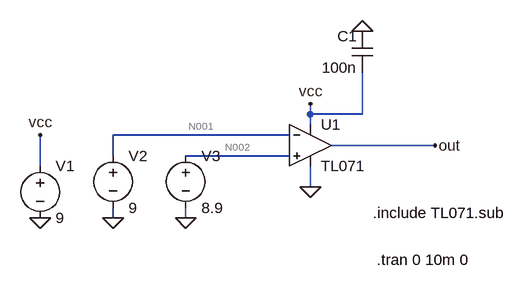
[diagram p0: schematic piezo_w_tl071.asc]
piezo_w_tl071.asc, the LTspice schematic file:
Version 4
SHEET 1 968 680
WIRE 176 112 176 96
WIRE 256 112 256 48
WIRE 256 112 176 112
WIRE 176 128 176 112
WIRE 144 144 -128 144
WIRE 368 160 208 160
WIRE -128 176 -128 144
WIRE 144 176 -16 176
WIRE -240 192 -240 144
WIRE 176 224 176 192
WIRE -128 272 -128 256
WIRE -16 272 -16 256
FLAG 176 224 0
FLAG 176 96 vcc
FLAG -240 272 0
FLAG -240 144 vcc
FLAG 256 -16 0
FLAG -128 272 0
FLAG -16 272 0
FLAG 368 160 out
SYMBOL Opamps\\opamp2 176 96 R0
SYMATTR InstName U1
SYMATTR Value TL071
SYMBOL voltage -240 176 R0
WINDOW 123 0 0 Left 2
WINDOW 39 0 0 Left 2
SYMATTR InstName V1
SYMATTR Value 9
SYMBOL cap 272 48 R180
WINDOW 0 24 56 Left 2
WINDOW 3 24 8 Left 2
SYMATTR InstName C1
SYMATTR Value 100n
SYMBOL voltage -128 160 R0
WINDOW 123 0 0 Left 2
WINDOW 39 0 0 Left 2
SYMATTR InstName V2
SYMATTR Value 9
SYMBOL voltage -16 160 R0
WINDOW 123 0 0 Left 2
WINDOW 39 0 0 Left 2
SYMATTR InstName V3
SYMATTR Value 8.9
TEXT 272 264 Left 2 !.include TL071.sub
TEXT 278 336 Left 2 !.tran 0 10m 0

The netlist it stands for:
* piezo_w_tl071.asc
XU1 N002 N001 vcc 0 out TL071  ; pins In+ In- V+ V- OUT
V1 vcc 0 9
C1 vcc 0 100n
V2 N001 0 9
V3 N002 0 8.9
.include TL071.sub
.tran 0 10m 0
.backanno
.end

* Results of the author's LTspice run, read from the files saved beside the schematic
* Operating Point, zero values left out:
*   V(out) = 1.57 V
*   V(vcc) = 9 V
*   V(n001) = 9 V
*   V(n002) = 8.9 V
*   I(V3) = -38.86 pA
*   I(V2) = -39.18 pA
*   I(V1) = -4.395 mA
*   Ix(u1:1) = 38.86 pA
*   Ix(u1:2) = 39.18 pA
*   Ix(u1:3) = 4.395 mA
*   Ix(u1:4) = -4.361 mA
*   Ix(u1:5) = -194.7 pA
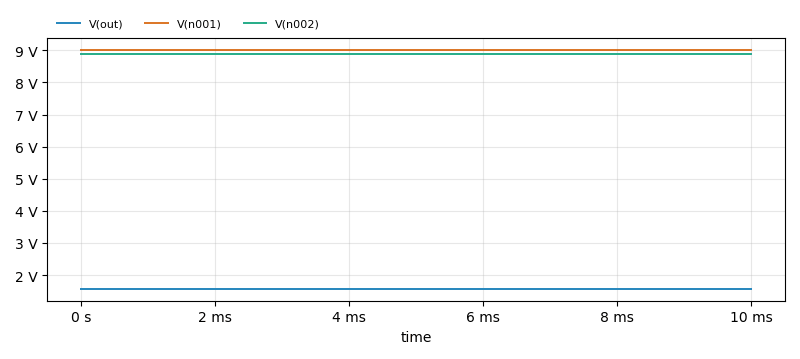
[diagram p1: Transient Analysis of piezo_w_tl071.asc, plotted from the saved traces]
* Transient Analysis, 1 run:
*   V(out): min 1.57 V, max 1.57 V, average 1.57 V, rms 1.57 V, last 1.57 V
*   V(n001): min 9 V, max 9 V, average 9 V, rms 9 V, last 9 V
*   V(n002): min 8.9 V, max 8.9 V, average 8.9 V, rms 8.9 V, last 8.9 V